# Altium schematic sheet misc_A.SchDoc
size 381 x 241 mm; SheetNumber: 3; SheetTotal: 6
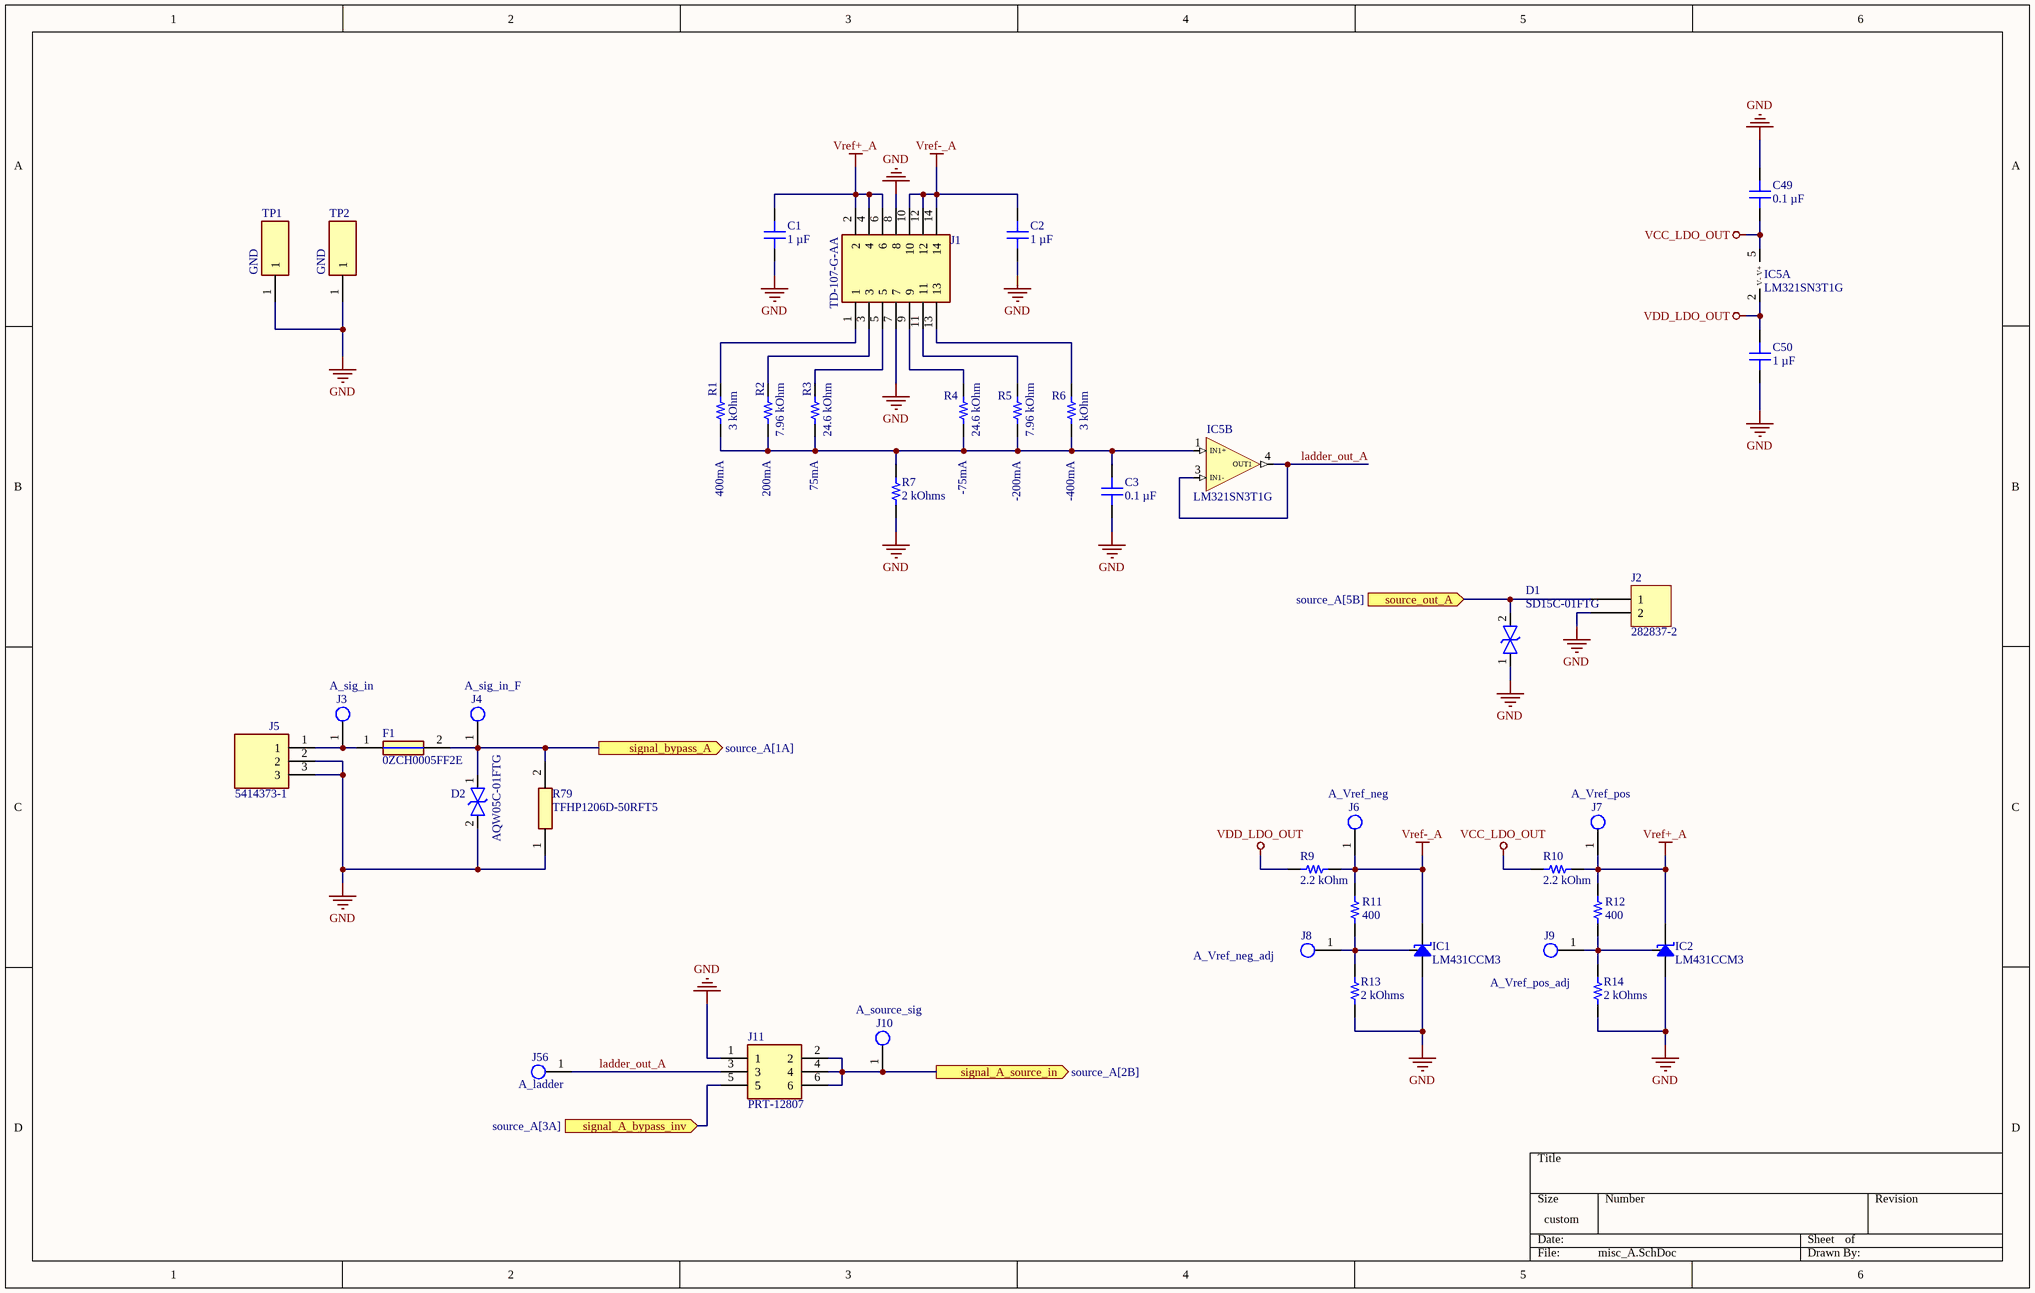
[diagram p0: misc_A.SchDoc]

## Parts
C1  1 µF  [CAP 1206_3216 - 0.8MM]
C2  1 µF  [CAP 1206_3216 - 0.8MM]
C3  0.1 µF  [CAP 1206_3216 - 0.8MM]
C49  0.1 µF  [CAP 1206_3216 - 0.8MM]
C50  1 µF  [CAP 1206_3216 - 0.8MM]
D1  SD15C-01FTG  [SD15C01FTG]
D2  AQW05C-01FTG  [SOD2613X100N]
F1  0ZCH0005FF2E  [FUSC3226X115N]
IC1  LM431CCM3  [SOT96P240X110-3N]
IC2  LM431CCM3  [SOT96P240X110-3N]
IC5  LM321SN3T1G  [SOT95P275X110-5N]  (parts A,B of 2)
J1  TD-107-G-AA  [HDRV14W46P254_2X7_1778X508X818P]
J2  282837-2  [TE 282837-2]
J3  A_sig_in  [FP-5001-MFG]
J4  A_sig_in_F  [FP-5001-MFG]
J5  5414373-1  [54143731]
J6  A_Vref_neg  [FP-5001-MFG]
J7  A_Vref_pos  [FP-5001-MFG]
J8  A_Vref_neg_adj  [FP-5001-MFG]
J9  A_Vref_pos_adj  [FP-5001-MFG]
J10  A_source_sig  [FP-5001-MFG]
J11  PRT-12807  [HDRV6W82P254_2X3_762X500X884P]
J56  A_ladder  [FP-5001-MFG]
R1  3 kOhm  [ERA3AEB101V]
R2  7.96 kOhm  [ERA3AEB101V]
R3  24.6 kOhm  [ERA3AEB101V]
R4  24.6 kOhm  [ERA3AEB101V]
R5  7.96 kOhm  [ERA3AEB101V]
R6  3 kOhm  [ERA3AEB101V]
R7  2 kOhms  [RES 1206_3216]
R9  2.2 kOhm  [RESC3116X65N]
R10  2.2 kOhm  [RESC3116X65N]
R11  400  [RESC3116X65N]
R12  400  [RESC3116X65N]
R13  2 kOhms  [RES 1206_3216]
R14  2 kOhms  [RES 1206_3216]
R79  TFHP1206D-50RFT5  [RESC3016X58N]
TP1  GND  [S175146R]
TP2  GND  [S175146R]

## Ports
signal_A_bypass_inv (in, see source_A[3A]), signal_A_source_in (out, see source_A[2B]), signal_bypass_A (out, see source_A[1A]), source_out_A (in, see source_A[5B])

## Nets
GND: C1.2 C2.1 C3.2 C49.1 C50.2 D1.1 D2.2 IC1.2(Anode) IC2.2(Anode) J1.7 J1.8 J2.2 J5.2 J5.3 J11.1 R7.1 R13.1 R14.1 R79.1 TP1.1 TP2.1
VCC_LDO_OUT: C49.2 IC5.5(V+) R10.2
VDD_LDO_OUT: C50.1 IC5.2(V-) R9.2
Vref+_A: C1.1 IC2.1(Cathode) J1.2 J1.4 J1.6 J7.1 R10.1 R12.2
Vref-_A: C2.2 IC1.1(Cathode) J1.10 J1.12 J1.14 J6.1 R9.1 R11.2
ladder_out_A: IC5.3(IN1-) IC5.4(OUT1) J11.3 J56.1
signal_A_bypass_inv: J11.5 ; port signal_A_bypass_inv
signal_A_source_in: J10.1 J11.2 J11.4 J11.6 ; port signal_A_source_in
signal_bypass_A: D2.1 F1.2 J4.1 R79.2 ; port signal_bypass_A
source_out_A: D1.2 J2.1 ; port source_out_A
NetC3_1: C3.1 IC5.1(IN1+) R1.1 R2.1 R3.1 R4.1 R5.1 R6.1 R7.2
NetF1_1: F1.1 J3.1 J5.1
NetIC1_3: IC1.3(Ref) J8.1 R11.1 R13.2
NetIC2_3: IC2.3(Ref) J9.1 R12.1 R14.2
NetJ1_1: J1.1 R1.2
NetJ1_3: J1.3 R2.2
NetJ1_5: J1.5 R3.2
NetJ1_9: J1.9 R4.2
NetJ1_11: J1.11 R5.2
NetJ1_13: J1.13 R6.2

## Notes on the sheet
- 400mA
- 200mA
- 75mA
- -75mA
- -200mA
- -400mA

## Library data of the parts
C1 C2 C50 = 885012208093: CAP CER 1UF 50V X7R 1206; manufacturer: Würth Elektronik; Tolerance: ±10%; Part Number: 885012208093; Capacitance: 1 µF; Applications: General Purpose; componentlink1description: Datasheet; componentlink1url: https://katalog.we-online.de/pbs/datasheet/885012208093.pdf; componentlink2description: DigiKey Link; componentlink2url: https://www.digikey.com/en/products/detail/würth-elektronik/885012208093/5453432; Device Package: 1206 (3216 Metric); lastupdated: 6/4/2024 19:10:33; Lifecycle Status: Active; Minimum Order: 1; Mounting Type: Surface Mount, MLCC; Operating Temperature: -55°C ~ 125°C; Package / Case: 1206 (3216 Metric); packaging: TapeAndReel; partid: 39665; Part Status: Active; price: 0.10; series: WCAP-CSGP; Size / Dimension: 0.126" L x 0.063" W (3.20mm x 1.60mm); Supplier 1: DigiKey; Supplier Part Number 1: 732-7577-1-ND; Temperature Coefficient: X7R; Thickness (Max): 0.075" (1.90mm); value: 1 µF; Voltage - Rated: 50V
C3 C49 = 885012208087: CAP CER 0.1UF 50V X7R 1206; manufacturer: Würth Elektronik; Tolerance: ±10%; Part Number: 885012208087; Capacitance: 0.1 µF; Applications: General Purpose; componentlink1description: Datasheet; componentlink1url: https://katalog.we-online.de/pbs/datasheet/885012208087.pdf; componentlink2description: DigiKey Link; componentlink2url: https://www.digikey.com/en/products/detail/würth-elektronik/885012208087/5453982; Device Package: 1206 (3216 Metric); lastupdated: 6/4/2024 19:10:27; Lifecycle Status: Active; Minimum Order: 1; Mounting Type: Surface Mount, MLCC; Operating Temperature: -55°C ~ 125°C; Package / Case: 1206 (3216 Metric); packaging: TapeAndReel; partid: 20879; Part Status: Active; price: 0.06; series: WCAP-CSGP; Size / Dimension: 0.126" L x 0.063" W (3.20mm x 1.60mm); Supplier 1: DigiKey; Supplier Part Number 1: 732-8127-1-ND; Temperature Coefficient: X7R; Thickness (Max): 0.035" (0.90mm); value: 0.1 µF; Voltage - Rated: 50V
D1 = SD15C-01FTG: TVS Diode (Bi-directional); Manufacturer_Name: LITTELFUSE; Datasheet Link: https://www.arrow.com/en/products/sd15c-01ftg/littelfuse; Height: 1.14mm; Manufacturer_Part_Number: SD15C-01FTG; Mouser Part Number: 576-SD15C-01FTG; Mouser Price/Stock: https://www.mouser.co.uk/ProductDetail/Littelfuse/SD15C-01FTG?qs=4zl93aaztU8pjSvpxpJP6g%3D%3D; Arrow Part Number: SD15C-01FTG; Arrow Price/Stock: https://www.arrow.com/en/products/sd15c-01ftg/littelfuse?region=nac
D2 = AQW05C-01FTG: TVS Diode (Bi-directional); Manufacturer_Name: LITTELFUSE; Datasheet Link: https://www.littelfuse.com/media?resourcetype=datasheets&itemid=80ae0bbb-a157-46a1-97eb-84c82c82e9e5&filename=littelfuse-tvs-diode-array-aqw05c-01ftg-datasheet; Height: 1mm; Manufacturer_Part_Number: AQW05C-01FTG; Mouser Part Number: 576-AQW05C-01FTG; Mouser Price/Stock: https://www.mouser.co.uk/ProductDetail/Littelfuse/AQW05C-01FTG?qs=Z%252BL2brAPG1JHH8XKoKQPyw%3D%3D
F1 = 0ZCH0005FF2E: Fuse; Manufacturer_Name: Bel; Datasheet Link: https://www.belfuse.com/resources/datasheets/circuitprotection/ds-cp-0zch-series.pdf; Height: 1.15mm; Manufacturer_Part_Number: 0ZCH0005FF2E; Mouser Part Number: 530-0ZCH0005FF2E
IC1 IC2 = LM431CCM3/NOPB: Integrated Circuit; Manufacturer_Name: Texas Instruments; Datasheet Link: http://www.ti.com/lit/gpn/lm431; Height: 1.12mm; Manufacturer_Part_Number: LM431CCM3/NOPB; Mouser Part Number: 926-LM431CCM3/NOPB; Mouser Price/Stock: https://www.mouser.co.uk/ProductDetail/Texas-Instruments/LM431CCM3-NOPB?qs=QbsRYf82W3GICygfDXnqiw%3D%3D; Arrow Part Number: LM431CCM3/NOPB; Arrow Price/Stock: https://www.arrow.com/en/products/lm431ccm3nopb/texas-instruments?utm_currency=USD&region=nac
IC5 = LM321SN3T1G: Integrated Circuit; Manufacturer_Name: onsemi; Datasheet Link: https://www.onsemi.com/pub/Collateral/LM321-D.PDF; Height: 1.1mm; Manufacturer_Part_Number: LM321SN3T1G; Mouser Part Number: 863-LM321SN3T1G; Mouser Price/Stock: https://www.mouser.co.uk/ProductDetail/onsemi/LM321SN3T1G?qs=slMPpRTKD5qNVsCzBsHVZA%3D%3D; Arrow Part Number: LM321SN3T1G; Arrow Price/Stock: https://www.arrow.com/en/products/lm321sn3t1g/on-semiconductor?utm_currency=USD&region=nac
J1 = TD-107-G-AA: Connector; Manufacturer_Name: SAMTEC; Datasheet Link: https://suddendocs.samtec.com/catalog_english/td.pdf?_gl=1*1wt4qt0*_ga*MTEzMjQwMzYxOS4xNjk3ODEzMDcx*_ga_3KFNZC07WW*MTcxMjgzNDUyOC40My4xLjE3MTI4MzQ1ODguNjAuMC4w; Height: 8.18mm; Manufacturer_Part_Number: TD-107-G-AA; Mouser Part Number: 200-TD107GAA; Mouser Price/Stock: https://www.mouser.co.uk/ProductDetail/Samtec/TD-107-G-AA?qs=0lQeLiL1qybxLJvA9lDIZA%3D%3D; Arrow Part Number: TD-107-G-AA; Arrow Price/Stock: https://www.arrow.com/en/products/td-107-g-aa/samtec
J2 = 282837-2: TERM BLK 2P SIDE ENT 5.08MM PCB; Manufacturer: TE Connectivity AMP Connectors; Current: 13.5 A; Mating Orientation: Horizontal with Board; Number of Levels: 1; Pitch: 0.200" (5.08mm); Positions Per Level: 2; Voltage: 300 V; Wire Gauge: 16-28 AWG; Wire Termination: Screw - Rising Cage Clamp; Part Number: 282837-2; Color: Green; ComponentLink1Description: Datasheet; ComponentLink1URL: https://www.te.com/commerce/DocumentDelivery/DDEController?Action=srchrtrv&DocNm=282837&DocType=Customer+Drawing&DocLang=English; ComponentLink2Description: DigiKey Link; ComponentLink2URL: https://www.digikey.com/en/products/detail/te-connectivity-amp-connectors/282837-2/2187973; Features: Interlocking (Side); LastUpdated: 6/21/2022 15:00:23; Lifecycle Status: Active; Minimum Order: 1; Mounting Type: Through Hole; Packaging: Tray; Part Status: Active; Price: 0.31; Series: Buchanan; Supplier 1: DigiKey; Supplier Part Number 1: A113320-ND
J3 J4 J6-J10 J56 = 5001: PC TEST POINT MINIATURE BLACK; Body Material: Bronze; Plating: Silver; Inside Diameter: 1.27mm; Hole Diameter: 1.6mm; Number of Ports: 1; Outside Diameter: 2.54mm; Insulation: Insulated; Insulation Material: Nylon; Mount: Through Hole; RoHS Compliant: Yes; Series: THM; Height: 0.3inch; Termination: Through Hole; Material: Nylon; Packaging: Bulk; Contact Material: Bronze; REACH SVHC: No SVHC; Contact Plating: Silver; Orientation: Straight; Lead Free: Lead Free; Package Quantity: 100; Length: 7.62mm; Flammability Rating: UL94 V-0; Number of Contacts: 1; Diameter: 2.54mm; Housing Color: Black; Color: Black; Supplier 1: Mouser; Supplier Part Number 1: 534-5001
J5 = 5414373-1: Connector; Manufacturer_Name: TE Connectivity; Datasheet Link: https://www.te.com/commerce/DocumentDelivery/DDEController?Action=srchrtrv&DocNm=1307191_BNC_Connectors&DocType=Catalog%20Section&DocLang=English&PartCntxt=5414373-1&DocFormat=pdf; Height: 8.64mm; Manufacturer_Part_Number: 5414373-1; Mouser Part Number: 571-5414373-1; Mouser Price/Stock: https://www.mouser.co.uk/ProductDetail/TE-Connectivity/5414373-1?qs=TEPVm9Ho6Ekg6JV7ffLu5g%3D%3D; Arrow Part Number: 5414373-1; Arrow Price/Stock: https://www.arrow.com/en/products/5414373-1/te-connectivity?utm_currency=USD&region=nac
J11 = PRT-12807: Connector; Manufacturer_Name: SparkFun; Datasheet Link: https://cdn.sparkfun.com/datasheets/Prototyping/00989.pdf; Height: 8.84mm; Manufacturer_Part_Number: PRT-12807; Mouser Part Number: 474-PRT-12807; Mouser Price/Stock: https://www.mouser.co.uk/ProductDetail/SparkFun/PRT-12807?qs=WyAARYrbSnYnpz4kKzOm4A%3D%3D; Arrow Part Number: PRT-12807; Arrow Price/Stock: https://www.arrow.com/en/products/prt-12807/sparkfun-electronics
R1 R6 = ERA-3AEB302V: Resistor; Manufacturer_Name: Panasonic; Datasheet Link: https://industrial.panasonic.com/cdbs/www-data/pdf/RDM0000/AOA0000C307.pdf; Height: 0.55mm; Manufacturer_Part_Number: ERA-3AEB302V; Mouser Part Number: 667-ERA-3AEB302V; Mouser Price/Stock: https://www.mouser.co.uk/ProductDetail/Panasonic/ERA-3AEB302V?qs=NcBTt3PsE6X1AHNczabKdw%3D%3D; Arrow Part Number: ERA-3AEB302V; Arrow Price/Stock: https://www.arrow.com/en/products/era-3aeb302v/panasonic?utm_currency=USD&region=nac
R2 R5 = TNPW06037K96BEEA: Resistor; Manufacturer_Name: Panasonic; Manufacturer_Part_Number: ERA-3AEB302V; Datasheet Link: https://industrial.panasonic.com/cdbs/www-data/pdf/RDM0000/AOA0000C307.pdf; Height: 0.55mm; Mouser Part Number: 667-ERA-3AEB302V; Mouser Price/Stock: https://www.mouser.co.uk/ProductDetail/Panasonic/ERA-3AEB302V?qs=NcBTt3PsE6X1AHNczabKdw%3D%3D; Arrow Part Number: ERA-3AEB302V; Arrow Price/Stock: https://www.arrow.com/en/products/era-3aeb302v/panasonic?utm_currency=USD&region=nac
R3 R4 = RT0603BRD0724K6L: Resistor; Manufacturer_Name: Panasonic; Manufacturer_Part_Number: ERA-3AEB302V; Datasheet Link: https://industrial.panasonic.com/cdbs/www-data/pdf/RDM0000/AOA0000C307.pdf; Height: 0.55mm; Mouser Part Number: 667-ERA-3AEB302V; Mouser Price/Stock: https://www.mouser.co.uk/ProductDetail/Panasonic/ERA-3AEB302V?qs=NcBTt3PsE6X1AHNczabKdw%3D%3D; Arrow Part Number: ERA-3AEB302V; Arrow Price/Stock: https://www.arrow.com/en/products/era-3aeb302v/panasonic?utm_currency=USD&region=nac
R7 R13 R14 = ERA-8AEB202V: RES SMD 2K OHM 0.1% 1/4W 1206; Manufacturer: Panasonic Electronic Components; Power (Watts): 0.25W, 1/4W; Temperature Coefficient: ±25ppm/°C; Part Number: ERA-8AEB202V; ComponentLink1Description: Datasheet; ComponentLink1URL: https://industrial.panasonic.com/cdbs/www-data/pdf/RDM0000/AOA0000C307.pdf; ComponentLink2Description: DigiKey Link; ComponentLink2URL: https://www.digikey.com/en/products/detail/panasonic-electronic-components/ERA-8AEB202V/3070866; Composition: Thin Film; Device Package: 1206 (3216 Metric); Features: Automotive AEC-Q200; Height - Seated (Max): 0.028" (0.70mm); LastUpdated: 2/9/2024 20:54:17; Lifecycle Status: Active; Minimum Order: 1; Number of Terminations: 2; Operating Temperature: -55°C ~ 155°C; Package / Case: 1206 (3216 Metric); Packaging: TapeAndReel; PartId: 34011; Part Status: Active; Price: 0.10; Ratings: AEC-Q200; Resistance: 2 kOhms; Series: ERA-8A; Size / Dimension: 0.126" L x 0.063" W (3.20mm x 1.60mm); Supplier 1: DigiKey; Supplier Part Number 1: P2.0KBCCT-ND; Supplier Device Package: 1206; Tolerance: ±0.1%; Value: 2 kOhms
R9 R10 = RT1206FRE072K2L: Resistor; Manufacturer_Name: YAGEO; Datasheet Link: https://www.mouser.com/datasheet/2/447/PYu_RT_1_to_0_01_RoHS_L_12-3003070.pdf; Height: 0.65mm; Manufacturer_Part_Number: RT1206FRE072K2L; Mouser Part Number: 603-RT1206FRE072K2L; Mouser Price/Stock: https://www.mouser.co.uk/ProductDetail/YAGEO/RT1206FRE072K2L?qs=yNCrj0CQcyJif6VASMbdeQ%3D%3D; Arrow Part Number: RT1206FRE072K2L; Arrow Price/Stock: https://www.arrow.com/en/products/rt1206fre072k2l/yageo?utm_currency=USD&region=nac
R11 R12 = RT1206BRD07400RL: Resistor; Manufacturer_Name: YAGEO; Datasheet Link: https://www.mouser.fr/datasheet/2/447/PYu_RT_1_to_0_01_RoHS_L_15-3461507.pdf; Height: 0.65mm; Manufacturer_Part_Number: RT1206BRD07400RL; Mouser Part Number: 603-RT1206BRD07400RL; Mouser Price/Stock: https://www.mouser.co.uk/ProductDetail/YAGEO/RT1206BRD07400RL?qs=NgbZBzc1CyGp8d%2FABgImbQ%3D%3D; Arrow Part Number: RT1206BRD07400RL; Arrow Price/Stock: null?region=nac
R79 = TFHP1206D-50RFT5: Resistor; Manufacturer_Name: TT Electronics; Datasheet Link: https://www.ttelectronics.com/TTElectronics/media/ProductFiles/Datasheet/TFHP.pdf; Height: 0.58mm; Manufacturer_Part_Number: TFHP1206D-50RFT5; Mouser Part Number: 756-TFHP1206B-50RFT5; Mouser Price/Stock: https://www.mouser.co.uk/ProductDetail/Welwyn-Components-TT-Electronics/TFHP1206D-50RFT5?qs=amGC7iS6iy%252ByF%2Fp2IEHb1w%3D%3D
TP1 TP2 = S1751-46R: Test Point; Manufacturer_Name: Harwin; Datasheet Link: https://cdn.harwin.com/pdfs/S1751R.pdf; Height: 2mm; Manufacturer_Part_Number: S1751-46R; Mouser Part Number: 855-S1751-46R; Mouser Price/Stock: https://www.mouser.co.uk/ProductDetail/Harwin/S1751-46R?qs=l6ZPVqNVZb71wETAKrfRig%3D%3D